# EAGLE design untitled (EAGLE 9.6.2)
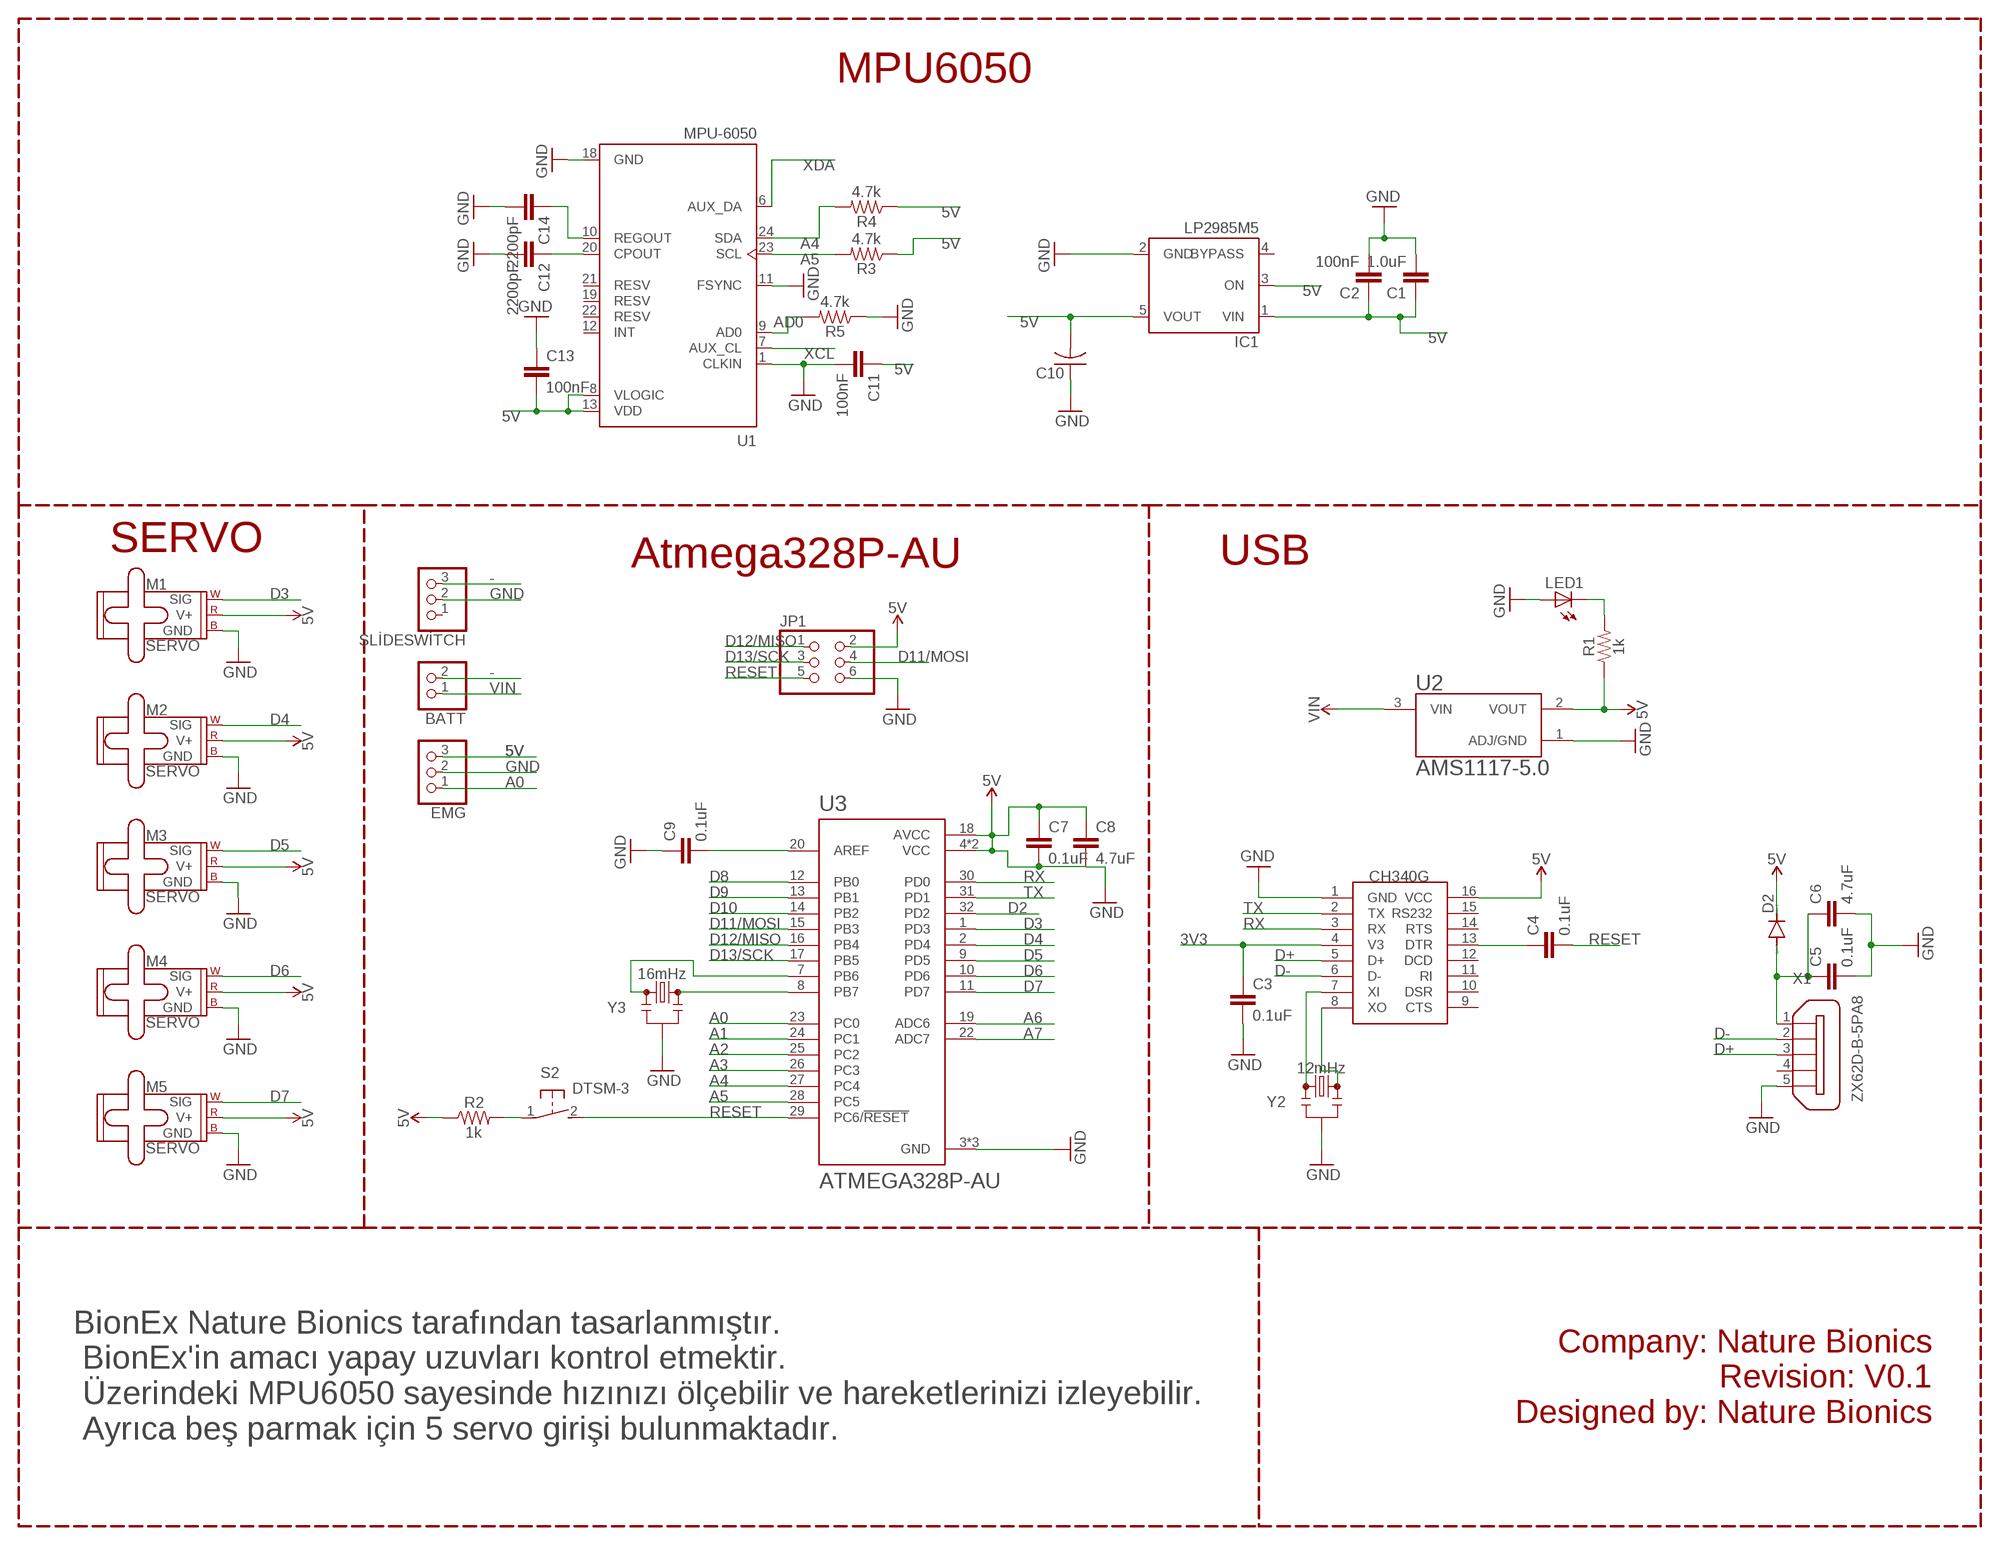
[diagram p0: schematic, sheet 1]

## Parts
BATT  PINHD-1X2  [1X02]
C1  1.0uF  1.0UF-0603-16V-10%  [0603]
C2  100nF  10NF-0603-50V-10%  [0603]
C3  0.1uF  1.0UF-0805-25V-(+80/-20%)  [0805]
C4  0.1uF  1.0UF-0805-25V-(+80/-20%)  [0805]
C5  0.1uF  1.0UF-0805-25V-(+80/-20%)  [0805]
C6  4.7uF  4.7UF0603  [0603]
C7  0.1uF  1.0UF-0805-25V-(+80/-20%)  [0805]
C8  4.7uF  4.7UF0603  [0603]
C9  0.1uF  1.0UF-0805-25V-(+80/-20%)  [0805]
C10  C-US_TANTALUM-1206(3216-METRIC)  [CAPM3216X180]
C11  100nF  10NF-0603-50V-10%  [0603]
C12  2200pF  2.2NF/2200PF-0603-50V-10%  [0603]
C13  100nF  10NF-0603-50V-10%  [0603]
C14  2200pF  2.2NF/2200PF-0603-50V-10%  [0603]
D2  DIODE-SOD123  [SOD123]
EMG  PINHD-1X3  [1X03]
IC1  LP2985M5  [SOT23-5]
JP1  PINHD-2X3  [2X03]
LED1  LEDCHIP-LED0805  [CHIP-LED0805]
M1  SERVO  [1X03]
M2  SERVO  [1X03]
M3  SERVO  [1X03]
M4  SERVO  [1X03]
M5  SERVO  [1X03]
R1  1k  1KOHM-0603-1/10W-1%  [0603]
R2  1k  1KOHM-0603-1/10W-1%  [0603]
R3  4.7k  4.7KOHM-0603-1/10W-1%  [0603]
R4  4.7k  4.7KOHM-0603-1/10W-1%  [0603]
R5  4.7k  4.7KOHM-0603-1/10W-1%  [0603]
S2  DTSM-3  [DTSM-3]
SLİDESWİTCH  PINHD-1X3  [1X03]
U1  MPU-6050  [QFN50P400X400X95-24N]
U2  AMS1117-5.0  AMS1117-3.3  [SOT229P700X180-4N]
U3  ATMEGA328P-AU  [QFP80P900X900X120-32N]
U$1  CH340G  [SOIC16]
X1  ZX62D-B-5PA8  [ZX62D-B-5PA8]
Y2  12mHz  RESONATORSMD-3.2X1.3  [RESONATOR-SMD-3.2X1.3]
Y3  16mHz  RESONATORSMD-3.2X1.3  [RESONATOR-SMD-3.2X1.3]

## Nets
3V3: C3.1 U$1.4(V3)
5V: C1.1 C2.1 C10.2 C11.1 C13.2 D2.C EMG.3 IC1.1(VIN) IC1.3(ON) IC1.5(VOUT) JP1.2 M1.2(V+) M2.2(V+) M3.2(V+) M4.2(V+) M5.2(V+) R1.1 R2.1 R3.1 R4.1 U1.8(VLOGIC) U1.13(VDD) U2.2(VOUT) U$1.16(VCC)
-: BATT.2 SLİDESWİTCH.3
A0: EMG.1 U3.23(PC0)
A1: U3.24(PC1)
A2: U3.25(PC2)
A3: U3.26(PC3)
A4: R4.2 U1.24(SDA) U3.27(PC4)
A5: R3.2 U1.23(SCL) U3.28(PC5)
A6: U3.19(ADC6)
A7: U3.22(ADC7)
AD0: R5.2 U1.9(AD0)
D2: U3.32(PD2)
D3: M1.1(SIG) U3.1(PD3)
D4: M2.1(SIG) U3.2(PD4)
D5: M3.1(SIG) U3.9(PD5)
D6: M4.1(SIG) U3.10(PD6)
D7: M5.1(SIG) U3.11(PD7)
D8: U3.12(PB0)
D9: U3.13(PB1)
D10: U3.14(PB2)
D11/MOSI: JP1.4 U3.15(PB3)
D12/MISO: JP1.1 U3.16(PB4)
D13/SCK: JP1.3 U3.17(PB5)
D+: U$1.5(D+) X1.3
D-: U$1.6(D-) X1.2
GND: C1.2 C2.2 C3.2 C5.2 C6.2 C7.1 C7.2 C8.1 C8.2 C9.1 C10.1 C11.2 C12.2 C13.1 C14.2 EMG.2 IC1.2(GND) JP1.6 LED1.A M1.3(GND) M2.3(GND) M3.3(GND) M4.3(GND) M5.3(GND) R5.1 SLİDESWİTCH.2 U1.1(CLKIN) U1.11(FSYNC) U1.18(GND) U2.1(ADJ/GND) U3.3(GND) U3.4(VCC) U3.5(GND) U3.6(VCC) U3.18(AVCC) U3.21(GND) U$1.1(GND) X1.5 Y2.2 Y3.2 ; supply symbol labelled 5V
N$1: LED1.C R1.2
N$2: C12.1 U1.20(CPOUT)
N$3: C14.1 U1.10(REGOUT)
N$4: U$1.7(XI) Y2.1
N$5: U$1.8(XO) Y2.3
N$7: C4.1 U$1.13(DTR)
N$8: C5.1 C6.1 D2.A X1.1
N$9: R2.2 S2.1
N$27: U3.8(PB7) Y3.3
N$28: U3.7(PB6) Y3.1
N$35: C9.2 U3.20(AREF)
RESET: C4.2 JP1.5 S2.2 U3.29(PC6/!RESET)
RX: U3.30(PD0) U$1.3(RX)
TX: U3.31(PD1) U$1.2(TX)
VIN: BATT.1 U2.3(VIN)
XCL: U1.7(AUX_CL)
XDA: U1.6(AUX_DA)
Unconnected: IC1.4(BYPASS) SLİDESWİTCH.1 U1.12(INT) U1.19(RESV) U1.21(RESV) U1.22(RESV) U$1.9(CTS) U$1.10(DSR) U$1.11(RI) U$1.12(DCD) U$1.14(RTS) U$1.15(RS232) X1.4 X1.S1 X1.S2 X1.S3 X1.S4

## Notes on the sheet
- MPU6050
- SERVO | USB
- Atmega328P-AU
- BionEx Nature Bionics tarafından tasarlanmıştır.
   BionEx'in amacı yapay uzuvları kontrol etmektir.
   Üzerindeki MPU6050 sayesinde hızınızı ölçebilir ve hareketlerinizi izleyebilir.
   Ayrıca beş parmak için 5 servo girişi bulunmaktadır.
- Company: Nature Bionics
  Revision: V0.1
  Designed by: Nature Bionics

## Library data of the parts
BATT = pinhead:PINHD-1X2: PIN HEADER
C1 = SparkFun-Capacitors:1.0UF: 1µF ceramic capacitors A capacitor is a passive two-terminal electrical component used to store electrical energy temporarily in an electric field.; PROD_ID: CAP-00868
C2 C11 C13 = SparkFun-Capacitors:10NF: 0.01uF/10nF/10,000pF ceramic capacitors A capacitor is a passive two-terminal electrical component used to store electrical energy temporarily in an electric field. CAP-09321; PROD_ID: CAP-00867; VALUE: 10nF
C3-C5 C7 C9 = SparkFun-Capacitors:1.0UF: 1µF ceramic capacitors A capacitor is a passive two-terminal electrical component used to store electrical energy temporarily in an electric field.; PROD_ID: CAP-11625; VALUE: 1.0uF
C6 C8 = SparkFun-Capacitors:4.7UF: 4.7µF ceramic capacitors A capacitor is a passive two-terminal electrical component used to store electrical energy temporarily in an electric field.; PROD_ID: CAP-08280
C10 = Capacitor:C-US: Capacitor - ANSI; CATEGORY: Capacitor
C12 C14 = SparkFun-Capacitors:2.2NF/2200PF: 2.2nF/2,200pF ceramic capacitors A capacitor is a passive two-terminal electrical component used to store electrical energy temporarily in an electric field.; PROD_ID: CAP-07877; VALUE: 2.2nF
D2 = diode:DIODE-: DIODE
EMG = adafruit:PINHD-1X3: PIN HEADER
IC1 = v-reg-3:LP2985: National Semiconductor <http://www.national.com> Micropower Linear Regulator 150mA regulated output, Vin 16V max., ultra-low dropout of 300mV @ 150mA, 1µA standby current, low noise
JP1 = pinhead:PINHD-2X3: PIN HEADER
LED1 = adafruit:LED: LED OSRAM: - CHIPLED LG R971, LG N971, LY N971, LG Q971, LY Q971, LO R971, LY R971 LH N974, LH R974 LS Q976, LO Q976, LY Q976 LO Q996 - Hyper CHIPLED LW Q18S LB Q993, LB Q99A, LB R99A - SideLED LS A670, LO A670, LY A670, LG A670, LP A670 LB A673, LV A673, LT A673, LW A673 LH A674 LY A675 LS A676, LA A676, LO A676, LY A676, LW A676 LS A679, LY A679, LG A679 - Hyper Micro SIDELED® LS Y876, LA Y876, LO Y876, LY Y876 LT Y87S - SmartLED LW L88C, LW L88S LB L89C, LB L89S, LG L890 LS L89K, LO L89K, LY L89K LS L896, LA L896, LO L896, LY L896 - TOPLED LS T670, LO T670, LY T670, LG T670, LP T670 LSG T670, LSP T670, LSY T670, LOP T670, LYG T670 LG T671, LOG T671, LSG T671 LB T673, LV T673, LT T673, LW T673 LH T674 LS T676, LA T676, LO T676, LY T676, LB T676, LH T676, LSB T676, LW T676 LB T67C, LV T67C, LT T67C, LS T67K, LO T67K, LY T67K, LW E67C LS E67B, LA E67B, LO E67B, LY E67B, LB E67C, LV E67C, LT E67C LW T67C LS T679, LY T679, LG T679 LS T770, LO T770, LY T770, LG T770, LP T770 LB T773, LV T773, LT T773, LW T773 LH T774 LS E675, LA E675, LY E675, LS T675 LS T776, LA T776, LO T776, LY T776, LB T776 LHGB T686 LT T68C, LB T68C - Hyper Mini TOPLED® LB M676 - Mini TOPLED Santana® LG M470 LS M47K, LO M47K, LY M47K Source: http://www.osram.convergy.de/
M1-M5 = SparkFun-Electromechanical:SERVO: Servo Motor 3-pin connector for a standard servo motor (voltage supply, ground, and control signal.) SparkFun Products Servo - Generic (Sub-Micro Size) <https://www.sparkfun.com/products/9065> (ROB-09065) Servo - Generic High Torque Continuous Rotation (Standard Size) <https://www.sparkfun.com/products/9347> (ROB-09347) Servo - Generic High Torque (Standard Size) <https://www.sparkfun.com/products/11965> (ROB-11965)
R1 R2 = SparkFun-Resistors:1KOHM: 1kΩ resistor A resistor is a passive two-terminal electrical component that implements electrical resistance as a circuit element. Resistors act to reduce current flow, and, at the same time, act to lower voltage levels within circuits. - Wikipedia; PROD_ID: RES-07856
R3-R5 = SparkFun-Resistors:4.7KOHM: 4.7kΩ resistor A resistor is a passive two-terminal electrical component that implements electrical resistance as a circuit element. Resistors act to reduce current flow, and, at the same time, act to lower voltage levels within circuits. - Wikipedia; PROD_ID: RES-07857
S2 = switch-tact:DTSM-3
SLİDESWİTCH = pinhead:PINHD-1X3: PIN HEADER
U1 = MPU-6050:MPU-6050: MPU-6050 Six-Axis (Gyro + Accelerometer) MEMS MotionTracking™ Devices Check prices <https://pricing.snapeda.com/parts/MPU-6050/TDK%20InvenSense/view-part?ref=eda>; AVAILABILITY: Bad; DESCRIPTION: Accelerometer, Gyroscope, 6 Axis Sensor I²C Output; MF: TDK InvenSense; MP: MPU-6050; PACKAGE: VFQFN-24 TDK InvenSense; PRICE: None
U2 = AMS1117-3.3:AMS1117-3.3: Sot223/Pkg 1-Amp 3.3-Volt Low Drop Out Voltage Regulatator; AVAILABILITY: Unavailable; DESCRIPTION: Sot223/Pkg 1-Amp 3.3-Volt Low Drop Out Voltage Regulatator; MF: Advanced Monolithic Systems; MP: AMS1117-3.3; PACKAGE: SOT-89 ams; PRICE: None
U3 = ATMEGA328P-AU:ATMEGA328P-AU: ATmega Series 20 MHz 32 KB Flash 2 KB SRAM 8-Bit Microcontroller - TQFP-32 Check prices <https://pricing.snapeda.com/parts/ATMEGA328P-AU/Microchip%20Technology/view-part?ref=eda>; AVAILABILITY: Warning; DESCRIPTION: AVR AVR® ATmega Microcontroller IC 8-Bit 20MHz 32KB (16K x 16) FLASH 32-TQFP (7x7); MF: Microchip Technology; MP: ATMEGA328P-AU; PACKAGE: TQFP-32 Microchip; PRICE: None; PURCHASE-URL: https://pricing.snapeda.com/search/part/ATMEGA328P-AU/?ref=eda
U$1 = ch340g:CH340G
X1 = zx62d-b-5pa8-oshpark_10:ZX62D-B-5PA8: Micro USB Type B Connector - Standard, Shell Through Hole Source: http://www.hirose.co.jp/cataloge_hp/ed_ZX_20140804.pdf; MF: Hirose; MPN: ZX62D-B-5PA8; OC_FARNELL: 2300438; OC_NEWARK: 69W0712
Y2 Y3 = SparkFun-Clocks:RESONATOR: Resonators (Generic) Ceramic resonators are clock-generating components, often used to control timing in microcontrollers. They usually have 3 pins: two pins for oscillation, and one pin for ground. Compared to crystals, resonators have worse tolerance, but are usually much cheaper. Plus, they have built-in load capacitors! These devices are used on boards like the Arduino Pro 8MHz <https://www.sparkfun.com/products/11114> and Arduino Pro 16MHz <https://www.sparkfun.com/products/11113>.

## Board
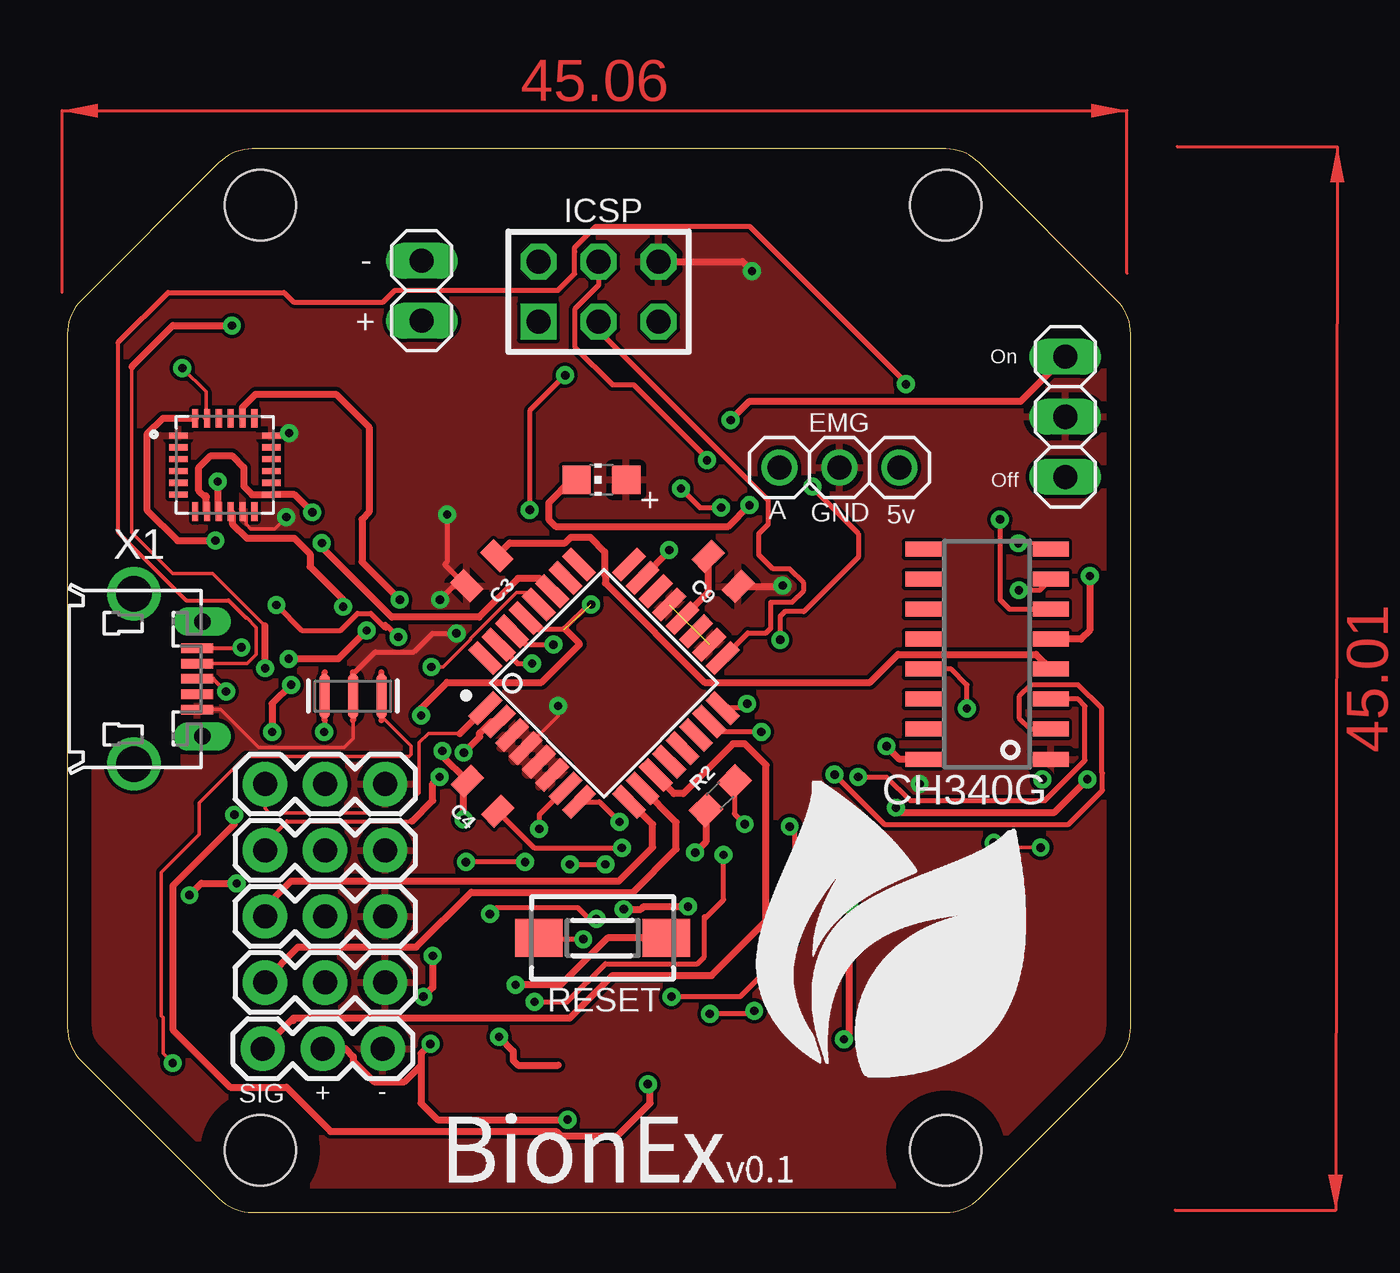
[diagram p1: board, top side]
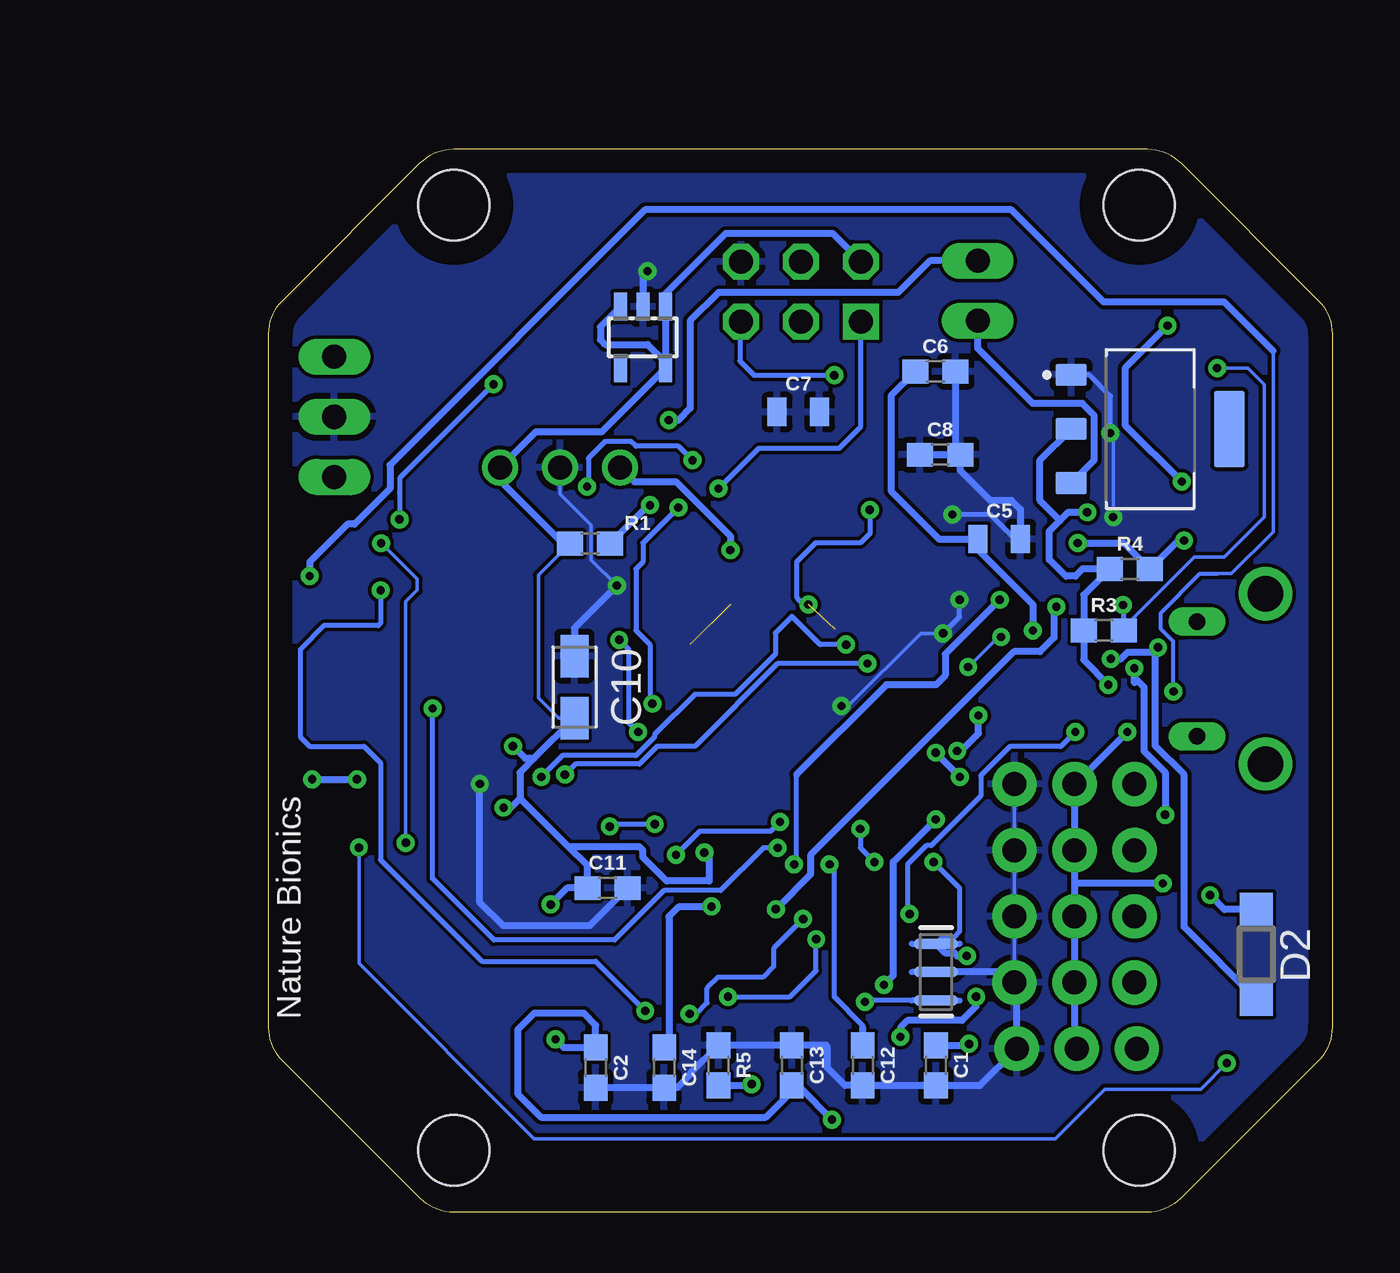
[diagram p2: board, bottom side, seen from below]

Size 45 x 45 mm. Coordinates in mm from the lower left corner, seen from the top.
Outline: 37.17,45 7.83,45 arc45 6.41,44.41 0.59,38.59 arc45 0,37.17 0,7.83 arc45 0.59,6.41 6.41,0.59 arc45 7.83,0 37.17,0 arc45 38.59,0.59 44.41,6.41 arc45 45,7.83 45,37.17 arc45 44.41,38.59 38.59,44.41 arc45 37.17,45
Copper layers (1*16): Top 0.035mm / dielectric 1.5mm / Bottom 0.035mm
Design rules "default": minimum track width 6mil, minimum drill 0.35mm, track to track 6mil, track to pad 6mil, pad to pad 6mil, via to via 6mil, smd to smd 6mil, copper to edge 40mil, drill to drill 6mil, minimum pad ring 10mil, minimum via ring 8mil, stop-mask expansion 4mil, vias tented up to drill 0mil, thermal gap 10mil
Holes 3 mm at 8.17,2.62 37.17,2.62 8.17,42.62 37.17,42.62

### Footprints (pad centres in the part's own frame; a part is rotated, then mirrored left to right if it is on the bottom)
1X02 = drill 1.016 long: 1 -1.27,0; 2 1.27,0
0603 = smd 1.1 x 1: 1 -0.85,0; 2 0.85,0
0805 = smd 0.8 x 1.2: 1 -0.9,0; 2 0.9,0
CAPM3216X180 = smd 1.796 x 1.189: 1 -1.31,0; 2 1.31,0
SOD123 = smd 1.4 x 1.4: A 1.9,0; C -1.9,0
1X03 = drill 1.016: 1 -2.54,0; 2 0,0; 3 2.54,0
SOT23-5 = smd 0.55 x 1.2: 1 -0.95,-1.3; 2 0,-1.3; 3 0.95,-1.3; 4 0.95,1.3; 5 -0.95,1.3
2X03 = drill 1.016 square: 1 -2.54,-1.27 | drill 1.016 octagon: 2 -2.54,1.27; 3 0,-1.27; 4 0,1.27; 5 2.54,-1.27; 6 2.54,1.27
CHIP-LED0805 = smd 1.2 x 1.2: A 0,-1.05; C 0,1.05
1X03' = drill 1.016 pad 1.88: 1 0,0; 2 2.54,0; 3 5.08,0
DTSM-3 = smd 2 x 1.6: 1 -2.7,0; 2 2.7,0
1X03'' = drill 1.016 long: 1 -2.54,0; 2 0,0; 3 2.54,0
QFN50P400X400X95-24N = smd 0.79 x 0.26: 1 -1.97,1.25; 2 -1.97,0.75; 3 -1.97,0.25; 4 -1.97,-0.25; 5 -1.97,-0.75; 6 -1.97,-1.25; 13 1.97,-1.25; 14 1.97,-0.75; 15 1.97,-0.25; 16 1.97,0.25; 17 1.97,0.75; 18 1.97,1.25 | smd 0.26 x 0.79: 7 -1.25,-1.97; 8 -0.75,-1.97; 9 -0.25,-1.97; 10 0.25,-1.97; 11 0.75,-1.97; 12 1.25,-1.97; 19 1.25,1.97; 20 0.75,1.97; 21 0.25,1.97; 22 -0.25,1.97; 23 -0.75,1.97; 24 -1.25,1.97
SOT229P700X180-4N = smd 0.93 x 1.31: 1 -2.29,-3.345; 2 0,-3.345; 3 2.29,-3.345 | smd 3.24 x 1.31: 4 0,3.345
QFP80P900X900X120-32N = smd 1.5 x 0.55: 1 -4.3,2.8; 2 -4.3,2; 3 -4.3,1.2; 4 -4.3,0.4; 5 -4.3,-0.4; 6 -4.3,-1.2; 7 -4.3,-2; 8 -4.3,-2.8; 17 4.3,-2.8; 18 4.3,-2; 19 4.3,-1.2; 20 4.3,-0.4; 21 4.3,0.4; 22 4.3,1.2; 23 4.3,2; 24 4.3,2.8 | smd 0.55 x 1.5: 9 -2.8,-4.3; 10 -2,-4.3; 11 -1.2,-4.3; 12 -0.4,-4.3; 13 0.4,-4.3; 14 1.2,-4.3; 15 2,-4.3; 16 2.8,-4.3; 25 2.8,4.3; 26 2,4.3; 27 1.2,4.3; 28 0.4,4.3; 29 -0.4,4.3; 30 -1.2,4.3; 31 -2,4.3; 32 -2.8,4.3
SOIC16 = smd 0.635 x 1.524: 1 -4.445,-2.695; 2 -3.175,-2.695; 3 -1.905,-2.695; 4 -0.635,-2.695; 5 0.635,-2.695; 6 1.905,-2.695; 7 3.175,-2.695; 8 4.445,-2.695; 9 4.445,2.695; 10 3.175,2.695; 11 1.905,2.695; 12 0.635,2.695; 13 -0.635,2.695; 14 -1.905,2.695; 15 -3.175,2.695; 16 -4.445,2.695
ZX62D-B-5PA8 = smd 1.35 x 0.4: 1 4.825,1.3; 2 4.825,0.65; 3 4.825,0; 4 4.825,-0.65; 5 4.825,-1.3 | drill 1.5: S1 2.15,-3.6; S2 2.15,3.6 | drill 0.7 long: S3 5.05,2.425; S4 5.05,-2.425
RESONATOR-SMD-3.2X1.3 = smd 0.45 x 1.905: 1 -1.2,0; 2 0,0; 3 1.2,0

### Placement (x,y rotation side)
BATT  15,39 90 top
C1  16.77,6.22 270 bottom
C2  31.17,6.12 270 bottom
C3  17.54,27.15 225 top
C4  17.57,17.61 135 top
C5  14.09,28.49 0 bottom
C6  16.79,35.58 0 bottom
C7  22.59,33.87 0 bottom
C8  16.59,32.06 0 bottom
C9  27.75,27.12 135 top
C10  32.07,22.22 270 bottom
C11  30.67,13.72 0 bottom
C12  19.87,6.22 270 bottom
C13  22.87,6.22 270 bottom
C14  28.27,6.12 270 bottom
D2  3.21,10.92 270 bottom
EMG  32.67,31.52 0 top
IC1  29.17,37.02 180 bottom
JP1  22.48,38.96 0 top
LED1  22.6,31 90 top
M1  SERVO  [1X03']  8.37,18.12 0 top
M2  SERVO  [1X03']  8.37,15.32 0 top
M3  SERVO  [1X03']  8.37,12.52 0 top
M4  SERVO  [1X03']  8.37,9.72 0 top
M5  SERVO  [1X03']  8.27,6.92 0 top
R1  31.4,28.3 0 bottom
R2  27.63,17.63 45 top
R3  9.67,24.62 0 bottom
R4  8.57,27.22 0 bottom
R5  25.97,6.22 270 bottom
S2  22.65,11.61 0 top
SLİDESWİTCH  [1X03'']  42.23,33.66 90 top
U1  6.67,31.62 0 top
U2  7.7,33.15 270 bottom
U3  22.71,22.39 45 top
U$1  38.92,23.62 90 top
X1  0.67,22.57 0 top
Y2  12.09,21.84 0 top
Y3  16.77,10.17 270 bottom

### Tracks (layer width: path | path; a pad name or v marks a point on that pad's centre or on a via)
3V3
  Top 0.305: C3.1 18.72,28.32 21.07,28.32 21.31,28.57 22.12,28.57 22.74,27.95 22.74,26.95 22.77,26.93 22.77,26.62 26.97,22.42 33.97,22.42 35.15,23.61 40.99,23.61 U$1.4
5V  (via drill 0.35)
  Top 0.305: v10.37,29.62 9.62,30.37 U1.13 7.82,30.37 7.47,30.72 7.47,31.52 6.97,32.02 6.07,32.02 5.57,31.52 5.57,30.52 5.87,30.22 | v35.07,17.12 35.27,16.92 41.77,16.92 v43.17,18.32 | R2.1 27.03,15.68 v26.57,15.22 | v33.07,13.02 33.07,7.52 v32.87,7.32 | v15.37,7.12 14.97,6.72 14.97,6.22 | v21.17,3.92 15.67,3.92 14.97,4.62 14.97,6.22 | U$1.16 35.22,19.17 v34.67,19.72 | v9.47,22.32 8.67,21.52 v8.67,20.32 | M5.2 11.77,6.92 12.1,6.59 12.1,6.41 12.99,5.52 14.27,5.52 14.97,6.22 | v5.17,13.42 5.67,13.92 v7.17,13.92 | U1.8 5.87,29.7 5.87,30.22 | 5.87,30.32 5.87,30.22
  Bottom 0.152: R1.1 33.59,26.96 33.59,21.76 32.74,20.91 C10.2
  Bottom 0.305: v10.37,29.62 11.17,29.62 11.52,29.27 | 11.52,29.27 11.97,28.82 11.97,27.62 11.27,26.92 10.87,26.92 10.57,27.22 R4.1 10.52,26.12 R3.1 10.52,23.37 v9.47,22.32 | 11.52,29.27 12.37,30.12 12.37,31.83 U2.2 | JP1.2 21.13,41.42 25.67,41.42 28.22,38.87 IC1.1 IC1.5 | IC1.3 30.97,37.47 30.97,36.92 30.77,36.72 28.97,36.72 28.22,35.97 IC1.5 | IC1.5 30.92,33.02 33.71,33.02 EMG.3 35.21,30.96 32.54,28.3 R1.1 | C10.2 33.76,19.22 | 33.76,19.22 34.37,18.61 34.37,17.52 | 34.37,17.52 34.77,17.12 v35.07,17.12 | v43.17,18.32 v41.27,18.32 | 32.32,15.47 31.52,14.67 C11.1 32.37,13.72 v33.07,13.02 | 32.32,15.47 34.37,17.52 | v26.57,15.22 26.37,15.02 26.37,14.02 28.17,14.02 29.17,15.02 29.17,15.32 29.32,15.47 32.32,15.47 | v32.87,7.32 32.52,6.97 C2.1 31.17,7.92 31.67,8.42 33.77,8.42 34.47,7.72 34.47,5.02 33.47,4.02 23.97,4.02 22.87,5.12 22.87,5.22 | 22.87,5.22 C13.2 | C1.1 15.42,7.07 v15.37,7.12 | v21.17,3.92 22.47,5.22 22.87,5.22 | v34.67,19.72 34.16,19.22 33.76,19.22 | v8.67,20.32 10.87,18.12 M1.2 M2.2 10.91,13.92 | 10.91,13.92 M3.2 M4.2 10.91,7.02 M5.2 | D2.C 4.56,12.82 v5.17,13.42 | v7.17,13.92 10.91,13.92
-  (via drill 0.35)
  Top 0.305: v28.07,33.52 28.87,34.32 40.35,34.32 SLİDESWİTCH.3
  Bottom 0.305: BATT.2 17.02,40.27 18.37,38.92 25.97,38.92 27.17,37.72 27.17,34.02 27.67,33.52 v28.07,33.52
A0  (via drill 0.35)
  Top 0.305: v25.47,28.02 25.47,27.98 U3.23
  Bottom 0.305: EMG.1 29.53,30.92 27.77,30.92 25.47,28.62 v25.47,28.02
A4  (via drill 0.35)
  Top 0.305: U3.27 19.98,26.82 19.07,26.82 17.43,25.18 13.73,25.18 10.77,28.14 v10.77,28.32 | U1.24 4.04,33.59 3.37,32.92 3.37,29.72 4.67,28.42 v6.27,28.42
  Bottom 0.305: v10.77,28.32 8.82,28.32 R4.2 6.52,28.42 v6.27,28.42
A5  (via drill 0.35)
  Top 0.152: v4.87,35.72 5.87,34.72 5.87,33.64 | U3.28 19.44,26.23 19.01,26.23 17.07,24.29 17.07,24.25 15.91,23.08 v15.4,23.08
  Top 0.203: v8.85,25.7 9.92,24.63 11.57,24.63 12.28,25.34 12.84,25.34 13.3,24.89 13.3,24.88 | 13.47,24.71 13.3,24.88 | 13.3,24.88 13.46,24.88 13.56,24.78 13.58,24.78 v14.01,24.35
  Top 0.305: 5.87,33.64 U1.23
  Bottom 0.152: R3.2 8.82,24.75 5.84,27.72 4.57,27.72 2.87,29.42 2.87,35.02 3.57,35.72 v4.87,35.72 | v15.4,23.08 14.13,24.35 v14.01,24.35
  Bottom 0.203: R3.2 8.82,25.66 v8.85,25.7
AD0  (via drill 0.35)
  Top 0.152: 8.37,24.82 6.16,27.02 4.47,27.02 2.73,28.76 2.73,35.78
  Top 0.305: v8.37,23.02 8.37,24.82 | v6.97,37.52 4.47,37.52 2.73,35.78 | v6.37,30.92 6.37,29.7 U1.9 | v7.07,16.82 7.07,16.42 4.47,13.82 4.47,7.72 6.9,5.29 9.27,5.29 11.14,3.42 20.7,3.42 20.88,3.24 23.28,3.24 24.67,4.62 24.67,5.32 v24.57,5.42
  Bottom 0.305: R5.2 24.62,5.37 v24.57,5.42 | 8.37,22.4 8.37,22.62 | 8.37,22.62 v8.37,23.02 | v6.97,37.52 8.77,35.72 8.77,33.32 v6.37,30.92 | 8.37,22.62 7.97,22.22 7.97,19.52 7.07,18.62 v7.07,16.82
D3
  Top 0.152: M1.1 8.37,17.09 8.55,16.91 14.06,16.91 14.9,17.75 14.9,19.88 15.28,20.26 16.62,20.26
  Top 0.305: M1.1 8.37,18.62 | 16.62,20.26 U3.1
D4  (via drill 0.35)
  Top 0.178: 8.37,15.62 9.29,16.55 14.59,16.55
  Top 0.305: M2.1 8.37,15.62 | U3.2 17.94,20.77 17.48,20.3 17.45,20.3 17.45,20.12 v16.78,19.45 | 14.59,16.55 15.47,17.42 15.47,18.14 v15.75,18.42
  Bottom 0.305: v15.75,18.42 v16.78,19.45
D5
  Top 0.305: M3.1 8.37,12.92 9.47,14.02 23.34,14.02 24.77,15.45 24.77,16.42 23.82,17.37 U3.9
D6
  Top 0.305: M4.1 8.37,9.82 9.77,11.22 14.77,11.22 17.09,13.55 23.94,13.55 25.77,15.38 25.77,16.51 U3.10
D7
  Top 0.305: M5.1 9.47,8.12 | 9.47,8.12 9.57,8.12 | 9.47,8.12 9.57,8.22 21.27,8.22 23.07,10.02 27.27,10.02 29.57,12.32 29.57,18.92 28.67,19.82 28.17,19.82 26.07,17.72 25.67,17.72 24.9,18.49 U3.11
D11/MOSI  (via drill 0.35)
  Top 0.203: JP1.4 22.48,39.24 21.46,38.22 21.46,37.27 21.47,37.27 21.47,36.62 23.07,35.02 23.97,35.02 27.07,31.92 v27.07,31.83 | v31.53,30.72 31.53,30.66 33.47,28.72 33.47,27.72 31.17,25.42 30.37,25.42 30.16,25.22 v30.16,24.23 | v29.37,20.32 27.61,20.32 U3.15
  Bottom 0.203: v27.07,31.83 27.67,32.42 29.47,32.42 29.67,32.62 30.74,32.62 30.75,32.62 30.77,32.62 31.47,31.92 31.47,30.77 v31.53,30.72 | v30.16,24.23 29.77,23.83 29.77,20.72 v29.37,20.32
D12/MISO  (via drill 0.35)
  Top 0.203: v25.97,30.62 26.77,29.82 v27.67,29.82 | v28.77,21.52 28.58,21.33 U3.16
  Bottom 0.203: JP1.1 19.97,37.66 19.97,33.22 20.87,32.32 24.27,32.32 v25.97,30.62 | v27.67,29.82 29.17,28.32 29.17,27.52 29.47,27.22 29.47,24.62 28.87,24.02 28.87,21.62 v28.77,21.52
D13/SCK
  Top 0.203: U3.17 28.8,24.52 29.57,24.52 29.77,24.72 29.77,25.82 30.67,25.82 31.17,26.32 31.17,26.62 30.57,27.22 29.87,27.22 29.27,27.82 29.27,28.72 29.67,29.12 29.67,30.12 22.48,37.31 JP1.3
D+  (via drill 0.35)
  Top 0.178: X1.3 6.18,22.57 v6.72,22.04
  Top 0.305: v43.27,26.92 43.27,24.62 42.9,24.25 U$1.5
  Bottom 0.152: 4.87,27.02 4.27,27.02 2.5,28.79 2.5,36.45
  Bottom 0.178: 4.87,27.02 5.59,27.02 7.25,25.37 7.25,24.68 6.74,24.17 6.74,22.06 v6.72,22.04
  Bottom 0.305: 2.5,36.45 4.57,38.52 9.67,38.52 13.57,42.42 29.07,42.42 39.87,31.62 39.87,30.62 41.37,29.12 41.67,29.12 43.27,27.52 v43.27,26.92
D-  (via drill 0.35)
  Top 0.152: X1.2 7.61,23.23 7.99,23.61 7.99,24.76 7.58,25.16 7.55,25.16
  Top 0.178: 2.14,36.8 2.14,28.8 5.04,25.9 6.82,25.9 7.55,25.16
  Top 0.203: v35.48,35.04 35.48,35.11 28.87,41.72 22.37,41.72 21.47,40.82 21.47,40.65 21.46,40.65 21.46,39.72 20.77,39.02 13.87,39.02 13.37,38.52 9.57,38.52 9.17,38.92 4.27,38.92 2.14,36.8 | v39.47,29.32 39.47,25.92 39.87,25.52 U$1.6
  Bottom 0.203: v35.48,35.04 39.46,31.06 39.46,30.46 39.47,30.45 v39.47,29.32
GND  (via drill 0.35)  (1 unrouted)
  Top 0.152: U1.11 7.56,29.51 7.56,29.16 7.57,29.16 7.57,29.12 7.77,28.92 8.77,28.92 v9.27,29.42 | X1.5 6.49,21.27 8.09,19.68 11.72,19.68 12.09,20.05 Y2.2 | v20.76,21.43 20.76,21.01 U3.4
  Top 0.203: U1.18 9.12,32.87 9.22,32.97 v9.38,32.97 | Y2.2 12.09,22.78 13.03,23.72 14.67,23.72 15.45,24.5 v16.47,24.5 | v15.77,25.92 16.36,26.51 16.87,26.51 | 16.87,26.51 C3.2 | v16.07,29.52 16.07,27.52 15.97,27.42 15.97,27.41 16.87,26.51
  Top 0.305: JP1.6 28.56,40.23 v28.97,39.82 | C9.1 30.23,26.48 v30.27,26.52
  Bottom 0.152: v9.27,29.42 9.27,32.86 v9.38,32.97 | M1.3 M2.3 M3.3 M4.3 | v30.27,26.52 31.35,27.61 31.35,29.08 32.67,30.39 EMG.2 | v16.47,24.5 17.41,24.5 20.48,21.43 v20.76,21.43
  Bottom 0.203: v9.38,32.97 9.38,34.54 10.28,35.44 U2.1 | v16.47,24.5 15.77,25.2 v15.77,25.92 | C5.2 13.43,28.49 14.47,29.52 v16.07,29.52
  Bottom 0.305: C2.2 C14.2 27.72,5.27 27.17,5.82 27.17,5.87 R5.1 C13.1 21.42,7.07 21.37,7.02 21.37,6.12 20.62,5.37 C12.2 C1.2 14.9,5.37 M5.3 13.35,9.62 M4.3 13.89,10.17 Y3.2 | C11.2 31.42,12.12 35.07,12.12 36.07,13.12 v36.07,18.13 | C6.2 15.94,32.26 | C5.2 13.19,29.75 13.57,30.12 14.47,30.12 15.74,31.4 15.74,32.02 | 15.74,32.02 C8.2 | C8.1 15.78,32.06 15.74,32.02 | v28.97,39.82 29.17,39.62 IC1.2 | v30.27,26.52 32.07,24.72 C10.1
  pour Top: -5.27,50.56 -5.27,-5.32 50.61,-5.32 50.61,50.56
  pour Bottom: -10.35,55.64 -10.35,-10.4 55.69,-10.4 55.69,55.64
N$1  (via drill 0.35)
  Top 0.305: LED1.C 21.34,31 20.37,30.02 20.37,29.32 20.67,29.02 27.97,29.02 v28.87,29.92
  Bottom 0.305: v28.87,29.92 28.93,29.92 R1.2
N$2  (via drill 0.35)
  Top 0.203: v21.27,14.72 v22.77,14.72
  Top 0.305: U1.20 7.42,34.07 7.97,34.62 11.37,34.62 12.77,33.22 12.77,29.62 12.47,29.32 12.47,27.52 v14.07,25.92
  Bottom 0.203: 19.87,7.42 19.87,7.92 21.07,9.12 21.07,14.52 v21.27,14.72 | v22.77,14.72 22.67,14.82 22.67,18.52
  Bottom 0.305: v14.07,25.92 16.37,23.62 16.37,22.72 16.77,22.32 18.87,22.32 22.67,18.52 | 19.87,7.82 19.87,7.42 C12.1
N$3  (via drill 0.35)
  Top 0.305: U1.10 6.98,29.59 6.98,29.13 7.59,28.52 9.6,28.52 10.27,27.86 10.27,27.32 11.67,25.92 v11.67,25.62 | v23.54,12.83 24.27,12.83 24.38,12.94 v26.27,12.94
  Bottom 0.305: v11.67,25.62 11.77,25.52 11.77,24.32 12.37,23.72 13.47,23.72 22.07,15.12 22.07,14.3 v23.54,12.83 | v26.27,12.94 26.28,12.92 27.67,12.92 28.07,12.52 28.07,7.17 C14.1
N$4  (via drill 0.35)
  Top 0.203: Y2.1 10.89,20.35 v10.87,20.33 | U$1.7 41.14,26.32 v40.27,26.32 | v17.88,12.62 18.16,12.9 21.6,12.9 22.08,12.41 v22.39,12.41 | v29.07,8.52 28.94,8.4 v27.19,8.4
  Bottom 0.203: v10.87,20.33 11.48,19.71 13.64,19.71 14.87,18.49 14.87,17.62 16.97,15.52 17.17,15.52 17.97,14.72 17.97,12.71 v17.88,12.62 | v40.27,26.32 40.27,24.92 40.37,24.82 42.67,24.82 43.67,23.82 43.67,20.12 43.27,19.72 40.97,19.72 40.27,19.02 40.27,14.92 35.97,10.62 31.17,10.62 v29.07,8.52 | v22.39,12.41 23.63,11.17 23.63,10.41 24.09,9.95 25.99,9.95 26.45,9.49 26.45,8.86 26.91,8.4 v27.19,8.4
N$5  (via drill 0.35)
  Top 0.152: Y2.3 13.29,20.98 14.54,19.73 14.54,19.37 14.46,19.29 7.55,19.29 5.57,17.31 5.57,15.99 3.97,14.39 3.97,8.32 4.05,8.25 4.05,6.72 v4.46,6.32 | v41.18,15.44 39.41,15.44 v39.2,15.64 | v40.24,28.31 41.36,28.31 U$1.8
  Bottom 0.152: v4.46,6.32 5.56,5.22 9.62,5.22 11.72,3.12 33.77,3.12 41.18,10.53 v41.18,15.44 | v40.24,28.31 38.72,26.79 38.72,26.33 39.2,25.85 v39.2,15.64
N$7  (via drill 0.35)
  Top 0.203: C4.1 19.76,15.42 v23.47,15.42 | v38.07,21.32 38.07,22.32 37.41,22.98 U$1.13
  Bottom 0.203: v23.47,15.42 24.07,15.42 25.87,13.62 28.27,13.62 30.37,11.52 35.47,11.52 38.07,14.12 v38.07,21.32
N$8  (via drill 0.35)
  Top 0.178: X1.1 7.33,23.87 v7.37,23.91
  Top 0.305: 7.32,23.87 v7.37,23.91 | v12.67,24.62 11.47,23.42 v9.37,23.42
  Bottom 0.305: D2.A 6.27,12.08 6.27,18.52 7.49,19.75 7.49,23.78 v7.37,23.91 7.57,23.71 8.65,23.71 8.93,23.42 v9.37,23.42 | C6.1 18.67,34.55 18.67,30.52 16.63,28.49 C5.1 14.99,28.05 12.67,25.72 v12.67,24.62
N$9  (via drill 0.35)
  Top 0.203: R2.2 28.23,16.86 v28.67,16.42 | v30.57,16.32 30.77,16.12 30.77,11.42 28.47,9.12 v25.57,9.12 | v21.83,11.56 20,11.56 S2.1
  Top 0.305: S2.1 19.76,11.42
  Bottom 0.203: v28.67,16.42 30.47,16.42 v30.57,16.32 | v25.57,9.12 22.93,9.12 21.83,10.22 v21.83,11.56
N$27  (via drill 0.35)
  Top 0.203: v19.77,8.91 21.15,8.91 22.77,10.52 26.67,10.52 26.96,10.82 26.96,12.42 | 26.96,12.52 26.96,12.42 | U3.8 22.52,17.37 v23.37,16.52 | 26.96,12.42 27.77,13.23 v27.77,15.12
  Bottom 0.203: Y3.3 19.7,8.97 v19.77,8.91 | v23.37,16.52 23.77,16.12 26.77,16.12 v27.77,15.12
N$28  (via drill 0.35)
  Top 0.203: U3.7 19.97,16.82 v19.97,16.22 | v19.37,14.82 v16.87,14.82
  Top 0.305: v15.46,10.85 15.46,9.52 v15.07,9.12 | v18.27,7.42 18.87,6.82 18.87,6.42 19.07,6.22 20.77,6.22 | 20.98,17.94 U3.7
  Bottom 0.203: v19.97,16.22 19.97,15.42 v19.37,14.82 | v16.87,14.82 15.77,13.72 15.77,11.89 16.02,11.64 16.5,11.64 Y3.1
  Bottom 0.305: Y3.1 16.38,10.98 16,10.98 15.87,10.85 v15.46,10.85 | v15.07,9.12 15.07,8.72 15.67,8.12 17.97,8.12 18.27,7.82 v18.27,7.42
N$35
  Top 0.305: C9.2 27.11,26.23 U3.20
RESET  (via drill 0.35)  (1 unrouted)
  Top 0.203: v21.07,35.42 19.57,33.92 v19.57,29.72 | v22.17,25.72 22.07,25.72 21.04,24.7 | 21.01,24.67 19.97,24.67
  Top 0.305: S2.2 22.85,11.61 20.87,9.62 v18.97,9.62 | v16.78,16.62 16.78,18.09 C4.2 15.87,19.31 v15.87,19.52 | v14.97,21.02 14.97,21.32 16.07,22.42 20.07,22.42 21.67,24.02 21.67,24.07 21.04,24.7 | 19.97,24.67 19.49,25.15 U3.29
  Bottom 0.203: JP1.5 25.07,37.64 25.07,36.02 24.47,35.42 v21.07,35.42 | v19.57,29.72 19.57,28.72 19.97,28.32 21.87,28.32 22.67,27.52 22.67,26.02 22.37,25.72 v22.17,25.72
  Bottom 0.305: v18.97,9.62 18.57,10.02 18.57,14.83 v16.78,16.62 | v15.87,19.52 15.71,19.52 14.97,20.27 v14.97,21.02
RX  (via drill 0.35)
  Top 0.203: U3.30 19.38,24.02 v20.57,24.02 | v33.47,18.42 34.67,18.42 35.67,17.42 41.37,17.42 43.07,19.12 43.07,21.42 42.78,21.71 U$1.3
  Bottom 0.203: v20.57,24.02 21.67,24.02 22.87,25.22 23.57,24.52 23.57,23.62 25.27,21.92 26.97,21.92 28.67,20.22 28.67,20.12 29.47,19.32 32.57,19.32 v33.47,18.42
TX  (via drill 0.35)
  Top 0.203: U3.31 19.05,23.22 v19.67,23.22 | v32.47,18.52 34.57,16.42 42.37,16.42 43.8,17.86 43.8,18.59 43.77,18.62 43.77,21.32 42.77,22.32 40.77,22.32 40.27,21.82 40.27,20.92 40.75,20.44 U$1.2
  Bottom 0.203: v19.67,23.22 23.46,23.22 26.96,19.72 28.56,19.72 29.32,18.97 32.02,18.97 v32.47,18.52
VIN
  Bottom 0.305: U2.3 10.07,31.84 10.07,33.72 10.57,34.22 12.67,34.22 15,36.56 BATT.1
(copper drawn outside any net)
  shapes: Top area x2

### Text on the board
tNames: ICSP | - | + | On | EMG | Off | A | GND | 5v | RESET | SIG | + | -
bNames: Nature Bionics